# EAGLE design CMP_1_1 (EAGLE 8.3.2)
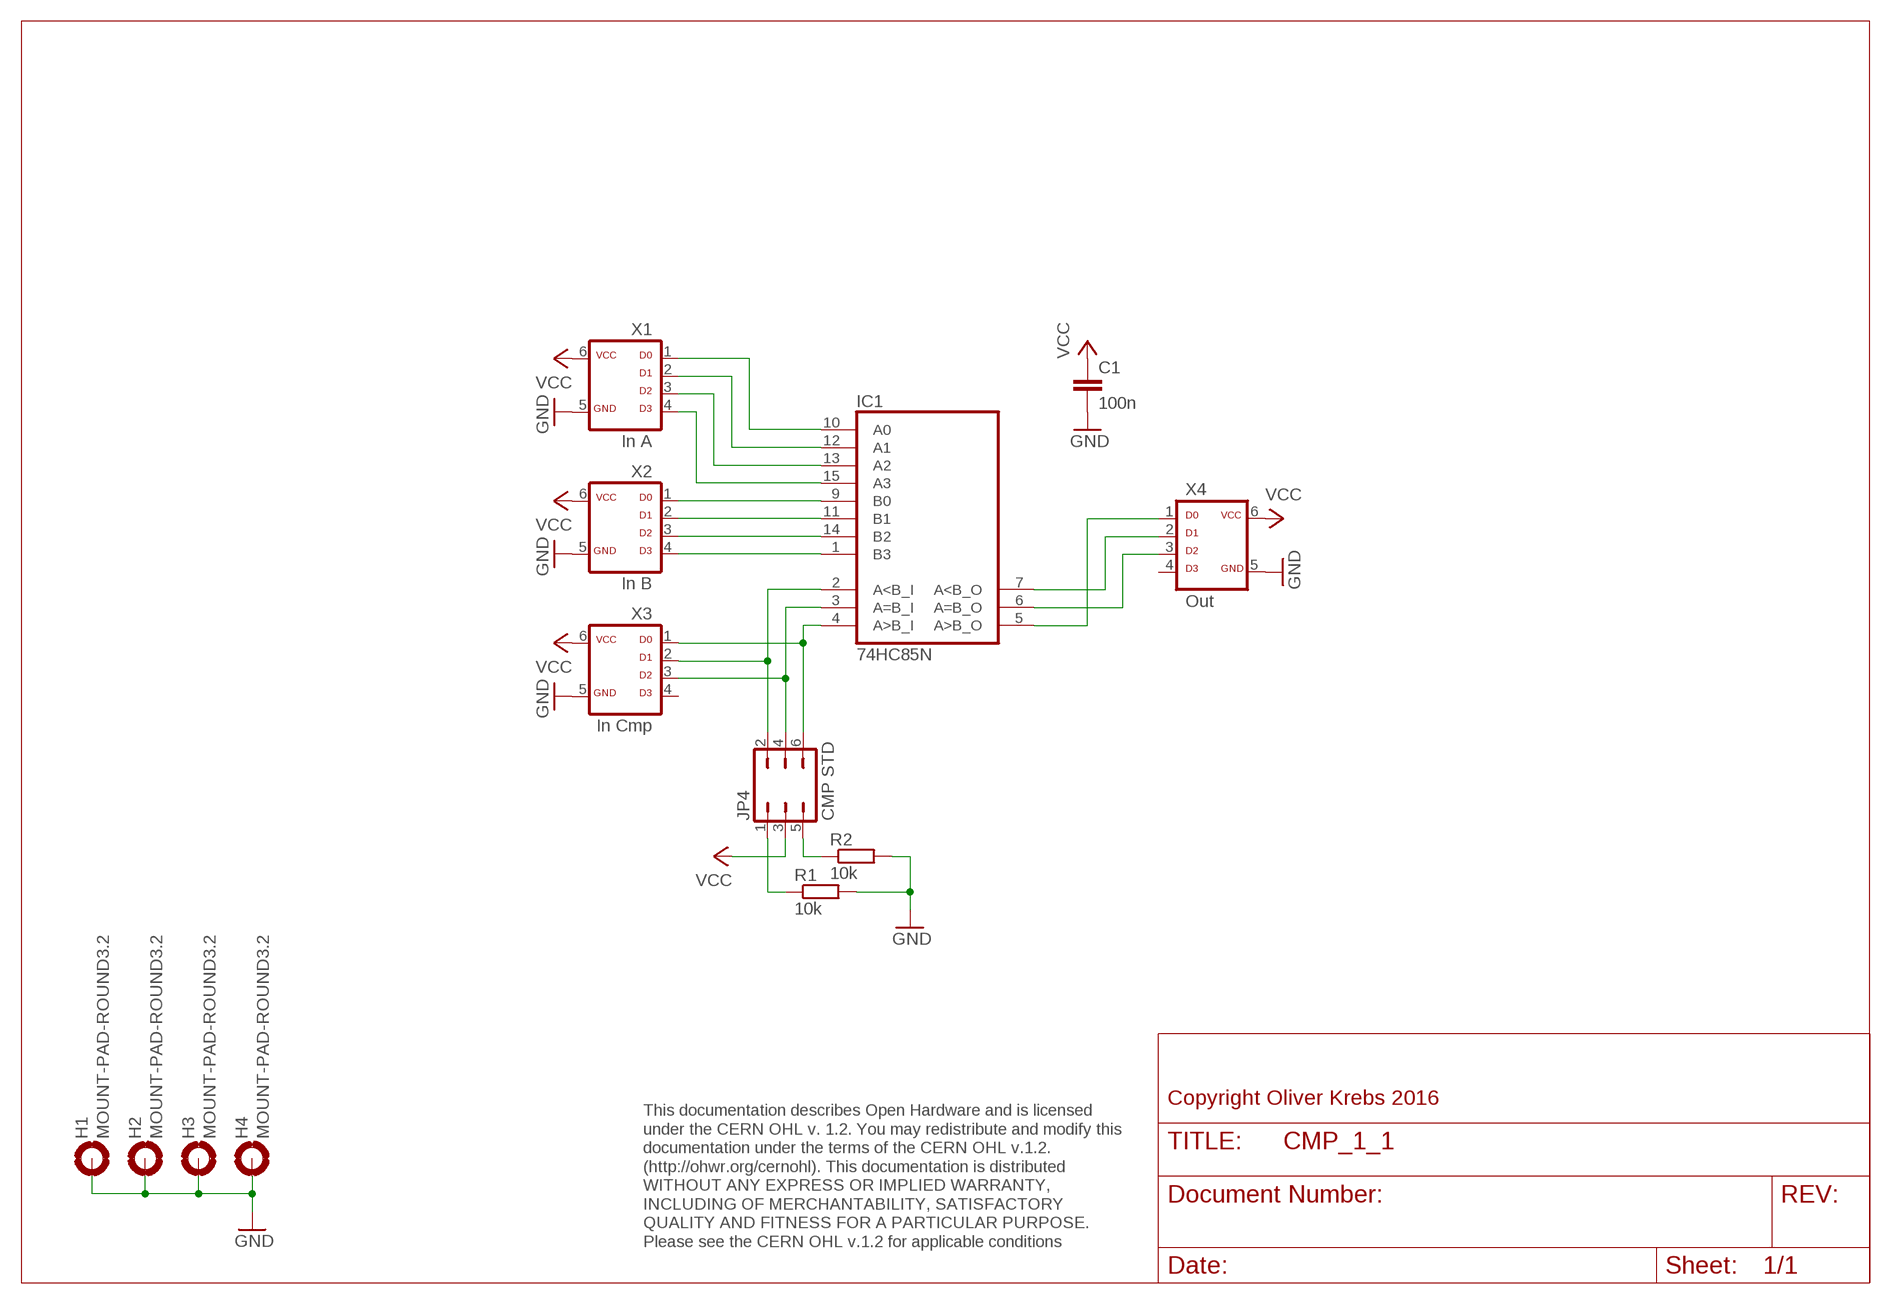
[diagram p0: schematic, sheet 1]

## Parts
C1  100n  C-EU050-025X075  [C050-025X075]
H1  MOUNT-PAD-ROUND3.2  [3,2-PAD]
H2  MOUNT-PAD-ROUND3.2  [3,2-PAD]
H3  MOUNT-PAD-ROUND3.2  [3,2-PAD]
H4  MOUNT-PAD-ROUND3.2  [3,2-PAD]
IC1  74HC85N  [DIL16]
JP4  CMP STD  JP3Q  [JP3Q]
R1  10k  R-EU_0207/10  [0207/10]
R2  10k  R-EU_0207/10  [0207/10]
X1  In A  ML6D  [ML-6]
X2  In B  ML6D  [ML-6]
X3  In Cmp  ML6D  [ML-6]
X4  Out  ML6D  [ML-6]

## Nets
GND: C1.2 H1.B3,2(MOUNT) H2.B3,2(MOUNT) H3.B3,2(MOUNT) H4.B3,2(MOUNT) R1.2 R2.2 X1.5 X2.5 X3.5 X4.5
N$1: IC1.10(A0) X1.1
N$2: IC1.12(A1) X1.2
N$3: IC1.13(A2) X1.3
N$4: IC1.15(A3) X1.4
N$5: IC1.9(B0) X2.1
N$6: IC1.11(B1) X2.2
N$7: IC1.14(B2) X2.3
N$8: IC1.1(B3) X2.4
N$9: IC1.3(A=B_I) JP4.4 X3.3
N$10: IC1.2(A<B_I) JP4.2 X3.2
N$11: IC1.4(A>B_I) JP4.6 X3.1
N$12: IC1.5(A>B_O) X4.1
N$13: IC1.7(A<B_O) X4.2
N$14: IC1.6(A=B_O) X4.3
N$16: JP4.1 R1.1
N$18: JP4.5 R2.1
VCC: C1.1 JP4.3 X1.6 X2.6 X3.6 X4.6
Unconnected: X3.4 X4.4

## Notes on the sheet
- Copyright Oliver Krebs 2016
- This documentation describes Open Hardware and is licensed 
  under the CERN OHL v. 1.2. You may redistribute and modify this 
  documentation under the terms of the CERN OHL v.1.2. 
  (http://ohwr.org/cernohl). This documentation is distributed
  WITHOUT ANY EXPRESS OR IMPLIED WARRANTY, 
  INCLUDING OF MERCHANTABILITY, SATISFACTORY 
  QUALITY AND FITNESS FOR A PARTICULAR PURPOSE. 
  Please see the CERN OHL v.1.2 for applicable conditions

## Power pins joined to a net without a drawn wire
GND: IC1.8(GND)
VCC: IC1.16(VCC)

## Library data of the parts
C1 = 01-my_rcl:C-EU: CAPACITOR, European symbol
H1-H4 = holes:MOUNT-PAD-ROUND: MOUNTING PAD, round
IC1 = 74xx-eu:74*85: 4-bit magnitude COMPARATOR
JP4 = 01-my-con:JP3Q
R1 R2 = 01-my_rcl:R-EU_: RESISTOR, European symbol
X1-X4 = 01-my-con:ML6D

## Board
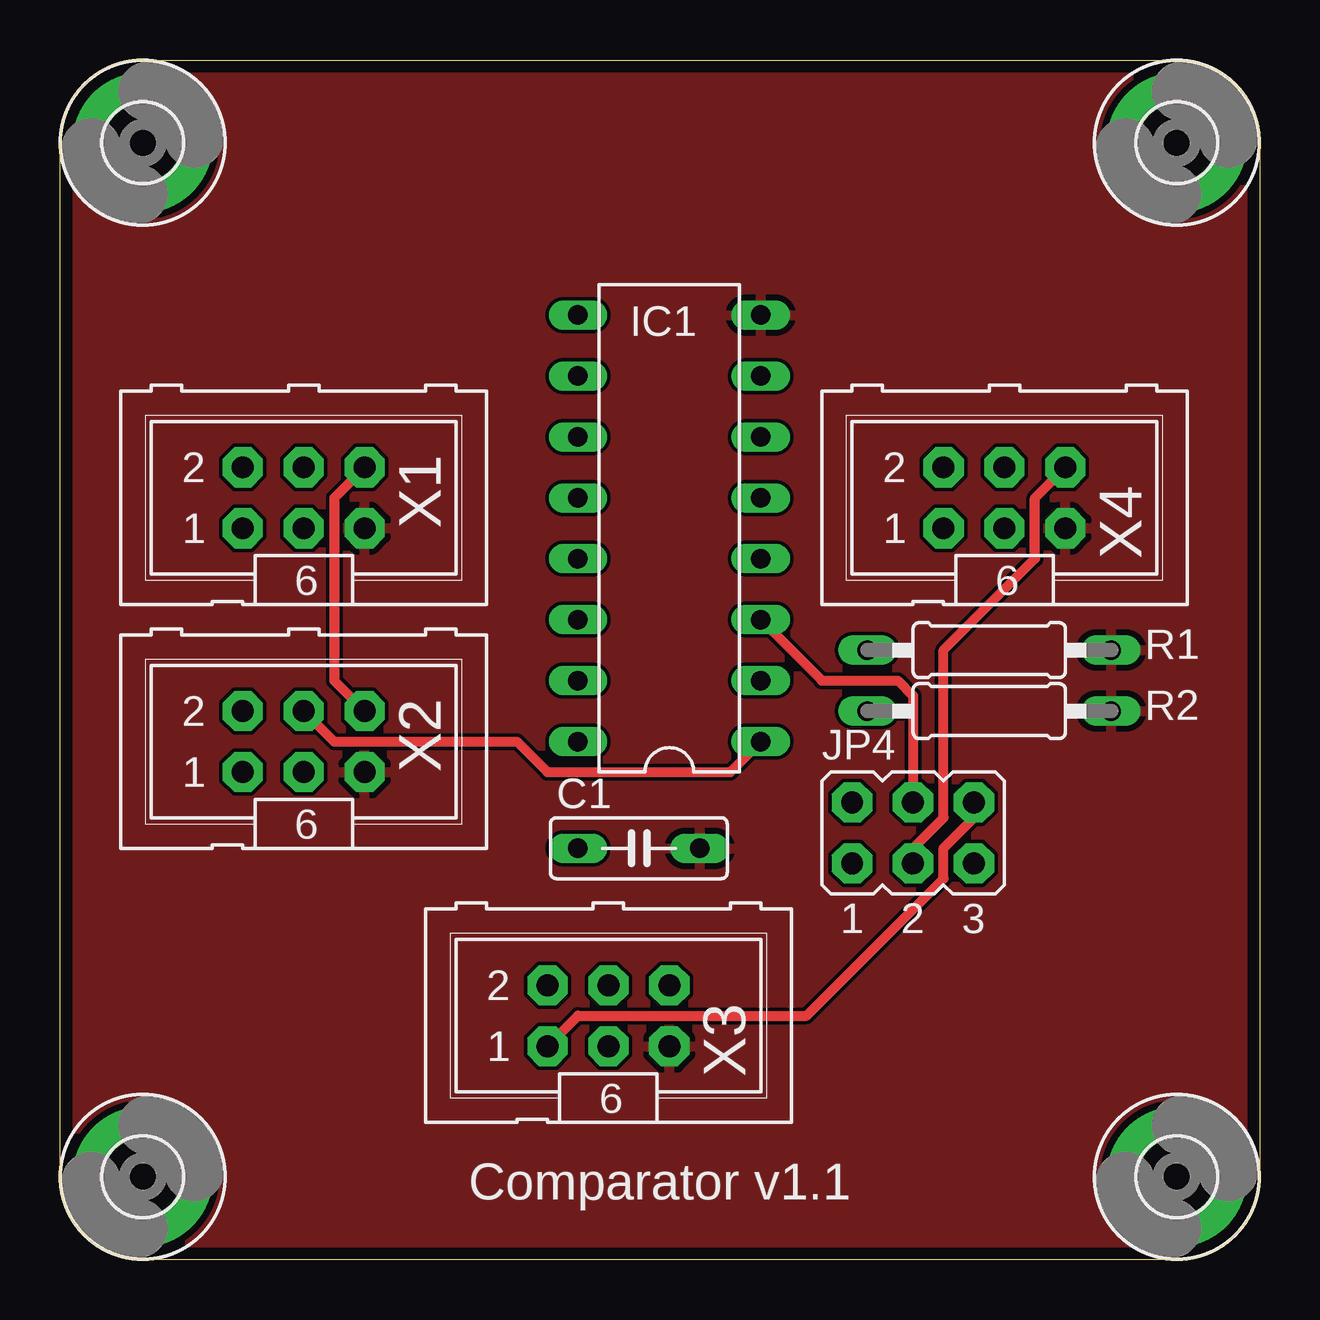
[diagram p1: board, top side]
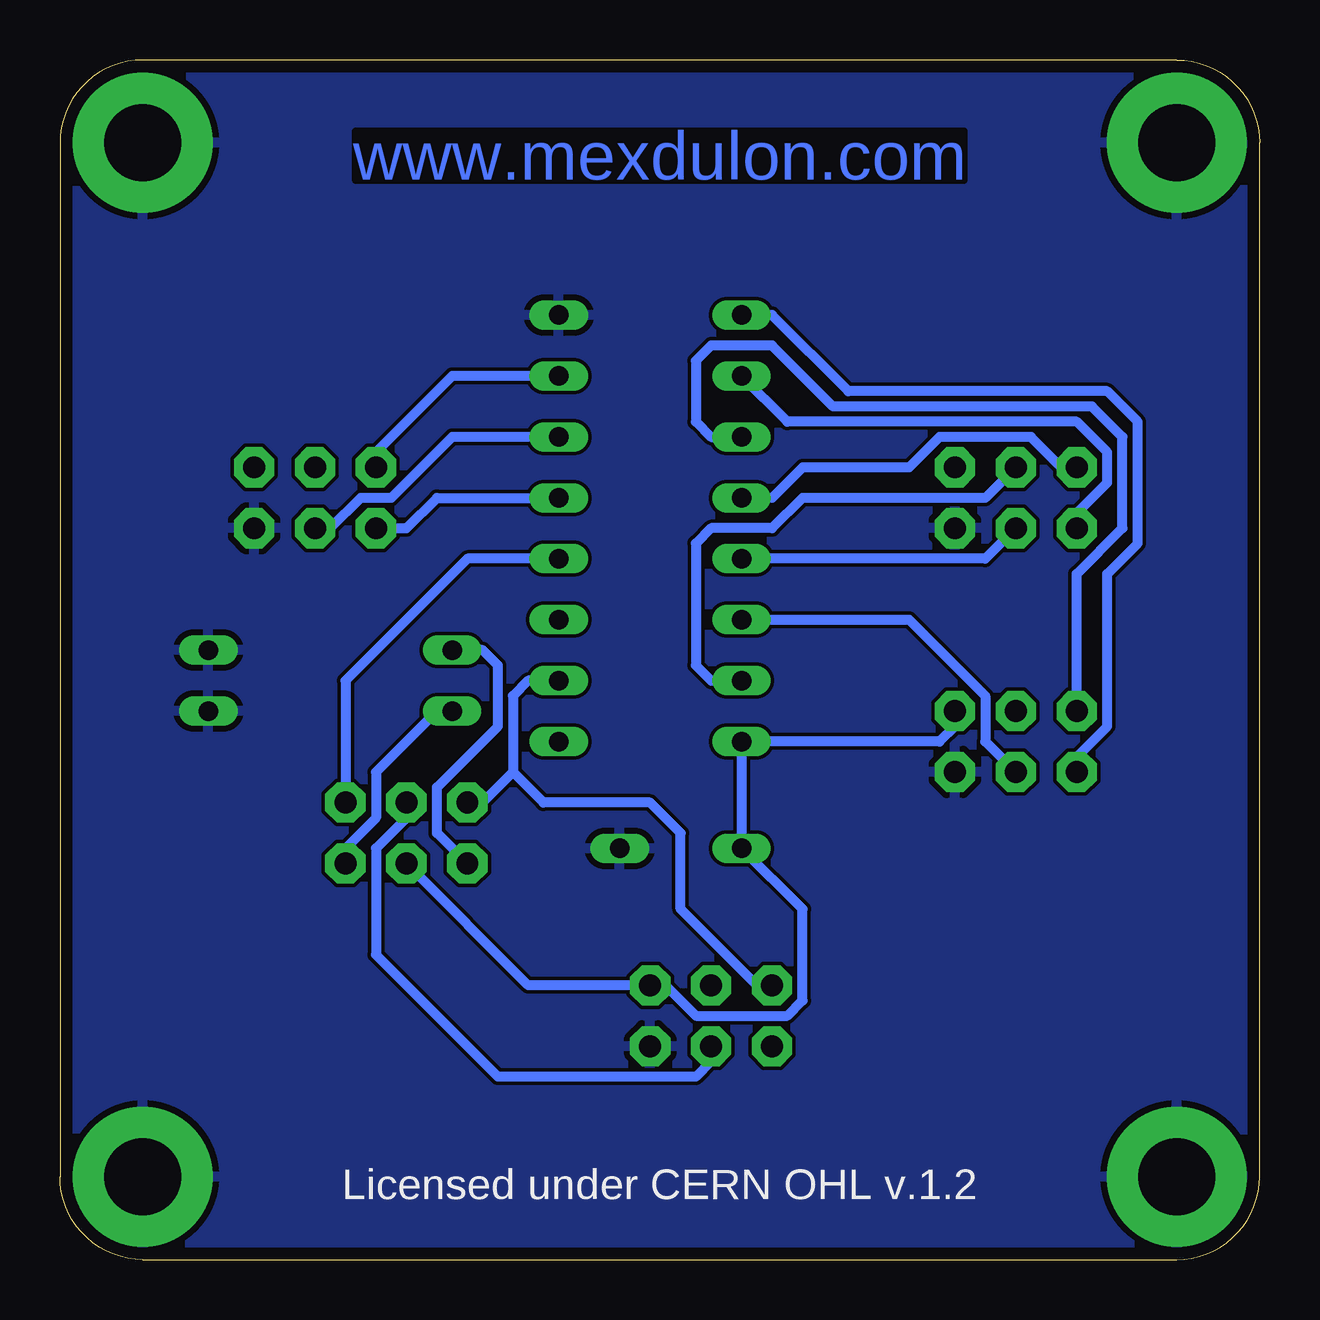
[diagram p2: board, bottom side, seen from below]

Size 50 x 50 mm. Coordinates in mm from the lower left corner, seen from the top.
Outline: 0,3.45 0,46.55 arc-90 3.45,50 46.55,50 arc-90 50,46.55 50,3.45 arc-90 46.55,0 3.45,0 arc-90 0,3.45
Copper layers (1*16): Top 0.035mm / dielectric 1.6mm / Bottom 0.035mm
Design rules "Elecrow_2-layer_PCB_eagle_rule": minimum track width 6mil, minimum drill 12mil, track to track 6mil, track to pad 6mil, pad to pad 6mil, via to via 8mil, smd to smd 0mil, copper to edge 20mil, drill to drill 10mil, minimum pad ring 6mil, minimum via ring 6mil, stop-mask expansion 0mil, vias tented up to drill 100mil, thermal gap 10mil

### Footprints (pad centres in the part's own frame; a part is rotated, then mirrored left to right if it is on the bottom)
C050-025X075 = drill 0.813 long: 1 -2.54,0; 2 2.54,0
3,2-PAD = drill 3.2 pad 5.842: B3,2 0,0
DIL16 = drill 0.813 long: 1 -8.89,-3.81; 2 -6.35,-3.81; 3 -3.81,-3.81; 4 -1.27,-3.81; 5 1.27,-3.81; 6 3.81,-3.81; 7 6.35,-3.81; 8 8.89,-3.81; 9 8.89,3.81; 10 6.35,3.81; 11 3.81,3.81; 12 1.27,3.81; 13 -1.27,3.81; 14 -3.81,3.81; 15 -6.35,3.81; 16 -8.89,3.81
JP3Q = drill 0.914 pad 1.676 octagon: 1 -2.54,-1.27; 2 -2.54,1.27; 3 0,-1.27; 4 0,1.27; 5 2.54,-1.27; 6 2.54,1.27
0207/10 = drill 0.813 long: 1 -5.08,0; 2 5.08,0
ML-6 = drill 0.914 pad 1.676 octagon: 1 -2.54,-1.27; 2 -2.54,1.27; 3 0,-1.27; 4 0,1.27; 5 2.54,-1.27; 6 2.54,1.27

### Placement (x,y rotation side)
C1  24.13,17.14 0 top
H1  3.45,3.45 0 top
H2  3.45,46.55 0 top
H3  46.55,46.55 0 top
H4  46.55,3.45 0 top
IC1  25.4,30.48 90 top
JP4  35.56,17.78 0 top
R1  38.73,25.4 0 top
R2  38.73,22.86 0 top
X1  10.16,31.75 0 top
X2  10.16,21.59 0 top
X3  22.86,10.16 0 top
X4  39.37,31.75 0 top

### Tracks (layer width: path | path; a pad name or v marks a point on that pad's centre or on a via)
GND
  pour Bottom: 0,0 50.8,0 50.8,50.16 0,50.16
  pour Top: 0,50.16 50.16,50.16 50.16,0 0,0
N$1
  Bottom 0.406: X1.1 7.62,31.11 6.35,32.38 6.35,33.66 7.62,34.92 19.68,34.92 IC1.10
N$2
  Bottom 0.406: X1.2 8.26,33.02 9.53,34.29 13.34,34.29 14.61,33.02 19.05,33.02 20.32,31.75 IC1.12
N$3
  Bottom 0.406: X1.3 11.43,29.21 IC1.13
N$4
  Bottom 0.406: X1.4 11.43,31.75 19.05,31.75 20.32,30.48 22.86,30.48 23.5,29.84 23.5,24.77 22.86,24.13 IC1.15
N$5
  Bottom 0.406: X2.1 7.62,20.95 6.35,22.23 6.35,28.57 5.08,29.84 5.08,34.92 6.35,36.2 17.14,36.2 20.32,39.37 IC1.9
N$6
  Bottom 0.406: X2.2 7.62,28.57 5.71,30.48 5.71,34.29 6.99,35.56 17.78,35.56 20.32,38.1 22.86,38.1 23.5,37.47 23.5,34.92 22.86,34.29 IC1.11
N$7
  Bottom 0.406: IC1.14 14.61,26.67 11.43,23.5 11.43,21.59 X2.3
N$8
  Top 0.406: X2.4 11.43,21.59 19.05,21.59 20.32,20.32 27.94,20.32 IC1.1
N$9
  Top 0.406: IC1.3 31.75,24.13 34.92,24.13 35.56,23.5 JP4.4
  Bottom 0.406: JP4.4 35.56,18.41 36.83,17.14 36.83,12.7 31.75,7.62 23.5,7.62 22.86,8.26 X3.3
N$10
  Bottom 0.406: IC1.2 30.48,24.13 31.11,23.5 31.11,20.32 | X3.2 20.95,11.43 24.13,14.61 24.13,17.78 25.4,19.05 29.84,19.05 31.11,20.32 | JP4.2 32.38,19.05 31.11,20.32
N$11
  Top 0.406: X3.1 21.59,10.16 31.11,10.16 36.83,15.88 36.83,17.14 38.1,18.41 JP4.6
  Bottom 0.406: IC1.4 33.02,29.21 38.1,24.13 JP4.6
N$12
  Bottom 0.406: X4.1 35.56,30.48 34.29,31.75 IC1.5
N$13
  Bottom 0.406: IC1.7 33.66,36.83 36.83,33.66 X4.2
N$14
  Bottom 0.406: IC1.6 33.66,34.29 36.2,31.75 37.47,31.75 38.73,30.48 X4.3
N$16
  Bottom 0.406: JP4.1 34.29,17.78 34.29,19.68 31.75,22.23 31.75,24.77 32.38,25.4 R1.1
N$18
  Bottom 0.406: R2.1 34.29,22.86 36.83,20.32 36.83,18.41 38.1,17.14 JP4.5
VCC
  Top 0.406: JP4.3 35.56,17.14 36.83,18.41 36.83,25.4 40.64,29.21 40.64,31.75 X4.6 | X1.6 11.43,31.75 11.43,24.13 X2.6
  Bottom 0.406: JP4.3 30.48,11.43 X3.6 24.77,11.43 23.5,10.16 19.68,10.16 19.05,10.79 19.05,14.61 C1.1 IC1.16 13.34,21.59 12.7,22.23 X2.6

### Text on the board
Bottom: www.mexdulon.com
tNames: Comparator v1.1
bNames: Licensed under CERN OHL v.1.2